# Altium schematic sheet WatchX_TEST_2.SchDoc
size A2
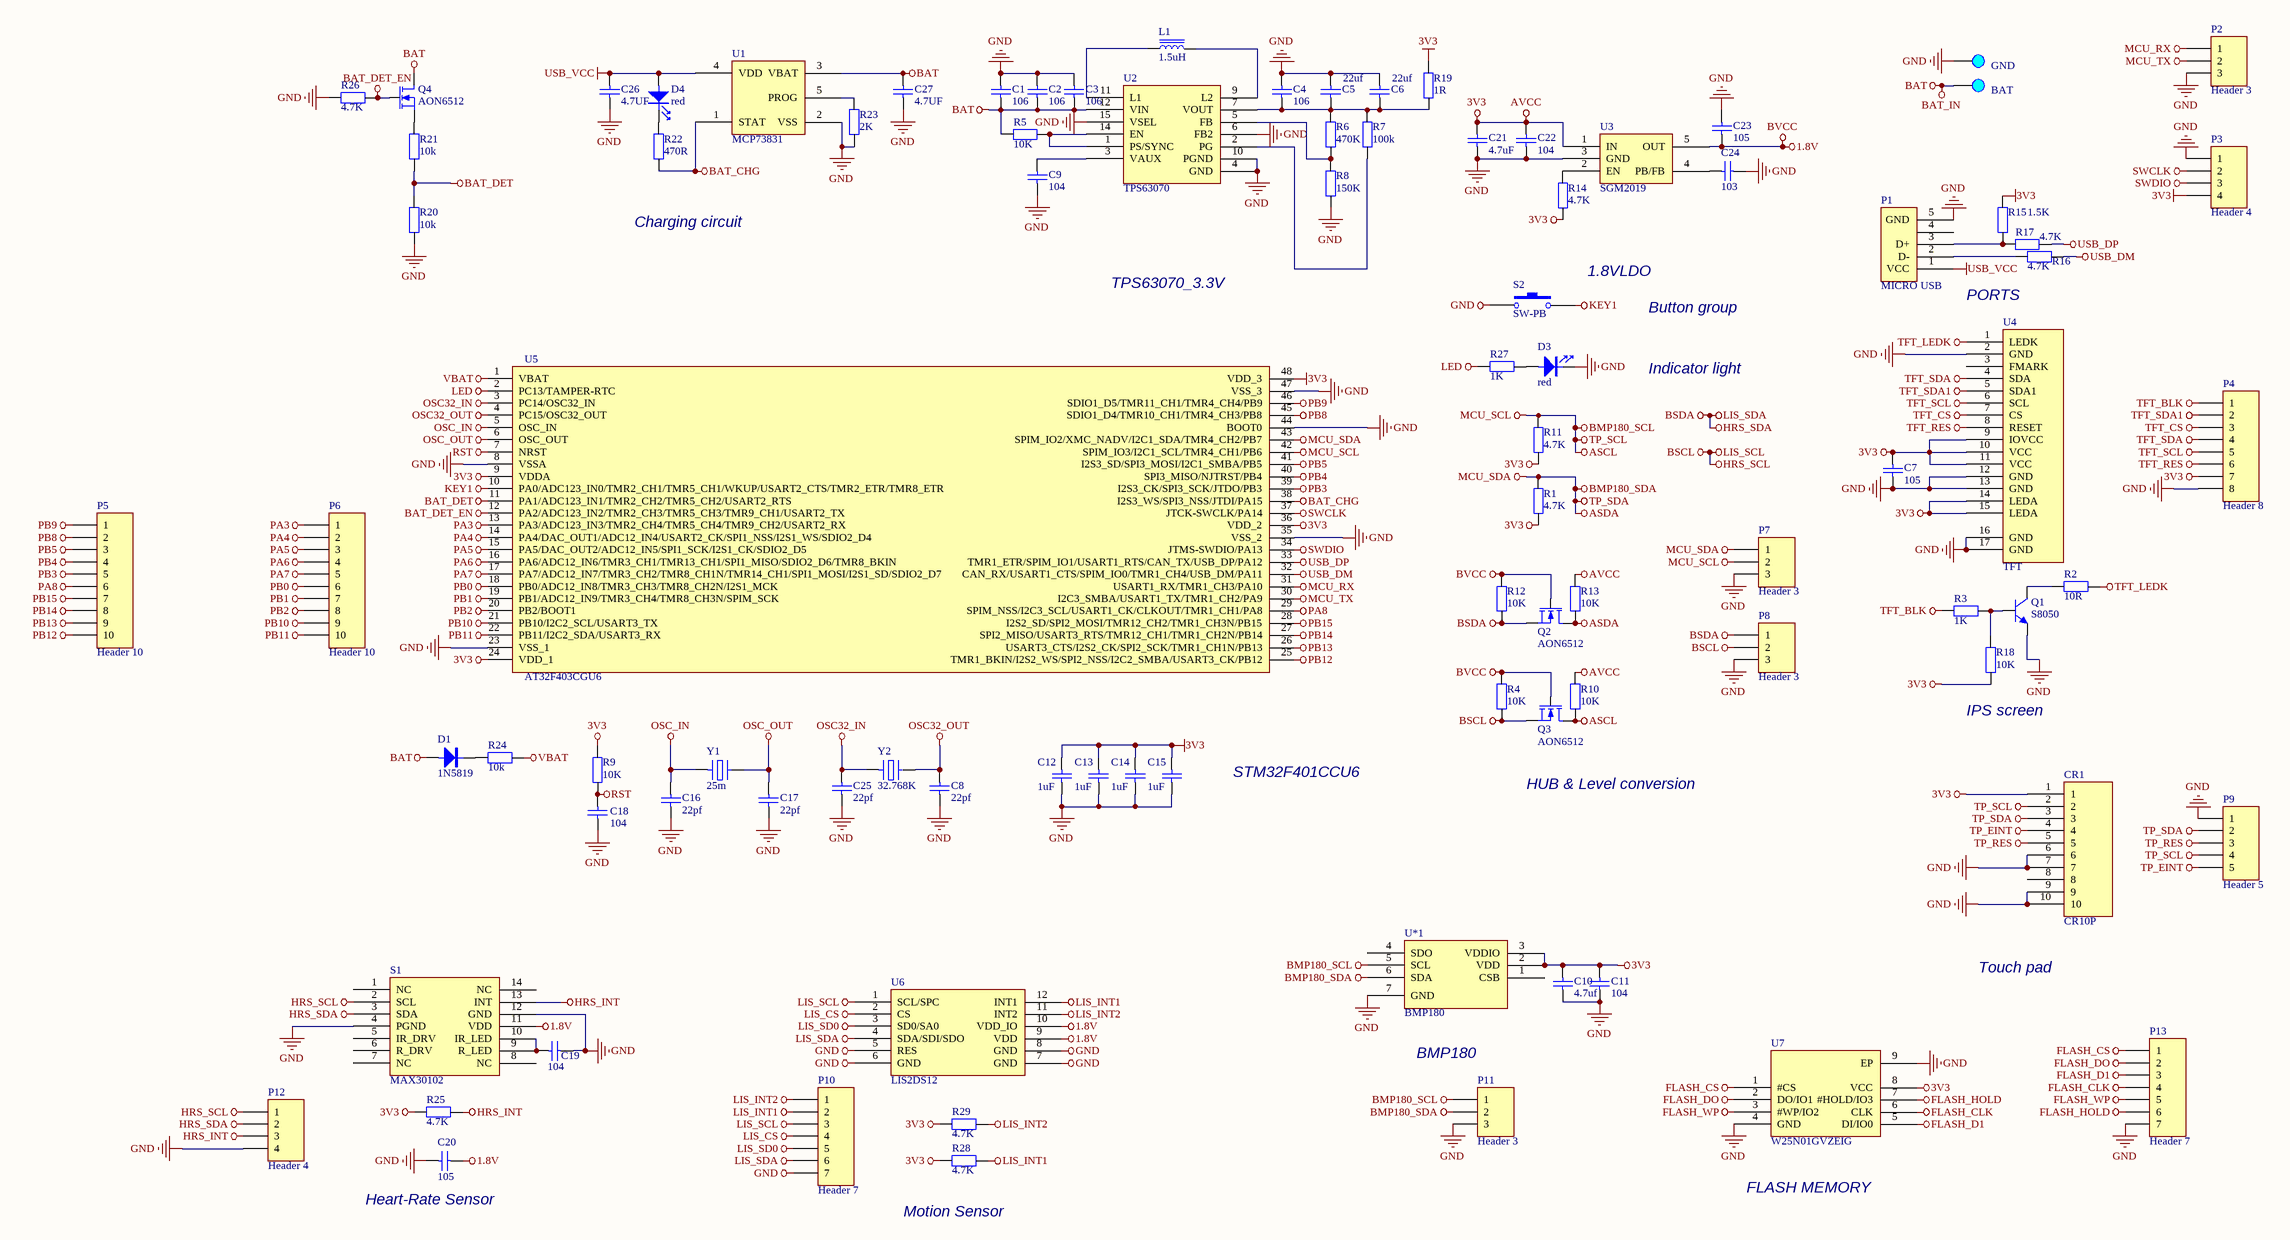
[diagram p0: WatchX_TEST_2.SchDoc]

## Parts
C1  106  [电容_C0805]
C2  106  [电容_C0805]
C3  106  [电容_C0603]
C4  106  [电容_C0603]
C5  22uf  [电容_C1206]
C6  22uf  [电容_C1206]
C7  105  [电容_C0603]
C8  22pf  [电容_C0603]
C9  104  [电容_C0603]
C10  4.7uf  [电容_C0603]
C11  104  [电容_C0603]
C12  1uF  [电容_C0603]
C13  1uF  [电容_C0603]
C14  1uF  [电容_C0603]
C15  1uF  [电容_C0603]
C16  22pf  [电容_C0603]
C17  22pf  [电容_C0603]
C18  104  [电容_C0603]
C19  104  [电容_C0603]
C20  105  [电容_C0603]
C21  4.7uF  [电容_C0603]
C22  104  [电容_C0603]
C23  105  [电容_C0603]
C24  103  [电容_C0603]
C25  22pf  [电容_C0603]
C26  4.7UF  [电容_C0805]
C27  4.7UF  [电容_C0805]
CR1  CR10P  [CONN RCPT 10POS 0.4MM]
D1  1N5819  [二极管_SOD-323]
D3  red  [LED_0603]
D4  red  [LED_0603]
L1  1.5uH  [变压器电感_0420]
P1  MICRO USB  [接插件_MICRO 牛角插座 USB 卷边]
P2  Header 3  [HDR1X3]
P3  Header 4  [HDR1X4]
P4  Header 8  [HDR1X8]
P5  Header 10  [HDR1X10]
P6  Header 10  [HDR1X10]
P7  Header 3  [HDR1X3]
P8  Header 3  [HDR1X3]
P9  Header 5  [HDR1X5]
P10  Header 7  [HDR1X7]
P11  Header 3  [HDR1X3]
P12  Header 4  [HDR1X4]
P13  Header 7  [HDR1X7]
Pad1  GND  [Pad_A]
Pad6  BAT  [Pad_A]
Q1  S8050  [三极管_SOT-23]
Q2  AON6512  [MOS_SOT-23]
Q3  AON6512  [MOS_SOT-23]
Q4  AON6512  [MOS_SOT-23]
R1  4.7K  [电阻_R0603]
R2  10R  [电阻_R0603]
R3  1K  [电阻_R0603]
R4  10K  [电阻_R0603]
R5  10K  [电阻_R0603]
R6  470K  [电阻_R0603]
R7  100k  [电阻_R0603]
R8  150K  [电阻_R0603]
R9  10K  [电阻_R0603]
R10  10K  [电阻_R0603]
R11  4.7K  [电阻_R0603]
R12  10K  [电阻_R0603]
R13  10K  [电阻_R0603]
R14  4.7K  [电阻_R0603]
R15  1.5K  [电阻_R0603]
R16  4.7K  [电阻_R0603]
R17  4.7K  [电阻_R0603]
R18  10K  [电阻_R0603]
R19  1R  [电阻_R0603]
R20  10k  [电阻_R0603]
R21  10k  [电阻_R0603]
R22  470R  [电阻_R0603]
R23  2K  [电阻_R0603]
R24  10k  [电阻_R0603]
R25  4.7K  [电阻_R0603]
R26  4.7K  [电阻_R0603]
R27  1K  [电阻_R0603]
R28  4.7K  [电阻_R0603]
R29  4.7K  [电阻_R0603]
S1  MAX30102  [MAX30102]
S2  SW-PB  [KEY_8*8mm]
U1  MCP73831  [SOT23-5]
U2  TPS63070  [VQFN-15-HR]
U3  SGM2019  [SOT23-5]
U4  TFT  [FPC-0.30mm-15P]
U5  AT32F403CGU6  [AT主控_QFN48(6X6)]
U6  LIS2DS12  [LGA-12_L2.0-W2.0-P0.50-BL]
U7  W25N01GVZEIG  [WSON-8]
U*1  BMP180  [LGA-7]
Y1  F: 25m  [晶振_2016]  (hidden comment: XTAL)
Y2  32.768K  [晶振_3215]

## Nets
1.8V: C20.1 C23.2 Q2.1(G) Q3.1(G) R4.1 R12.1 S1.11(VDD) U3.5(OUT) U6.9(VDD) U6.10(VDD_IO)  [also labelled BVCC]
3V3: C7.1 C10.2 C11.2 C12.2 C13.2 C14.2 C15.2 C21.1 C22.1 CR1.1 P3.4 P4.7 R1.2 R9.2 R10.1 R11.1 R13.1 R14.1 R15.2 R18.1 R19.2 R25.2 R28.2 R29.2 U3.1(IN) U4.9(IOVCC) U4.10(VCC) U4.11(VCC) U4.14(LEDA) U4.15(LEDA) U5.9(VDDA) U5.24(VDD_1) U5.36(VDD_2) U5.48(VDD_3) U7.8(VCC) U*1.2(VDD) U*1.3(VDDIO)  [also labelled AVCC]
ASCL: CR1.2 P7.2 P9.4 P11.1 Q3.2(D) R10.2 R11.2 U5.42(SPIM_IO3/I2C1_SCL/TMR4_CH1/PB6) U*1.5(SCL)  [also labelled BMP180_SCL, MCU_SCL, TP_SCL]
ASDA: CR1.3 P7.1 P9.2 P11.2 Q2.2(D) R1.1 R13.2 U5.43(SPIM_IO2/XMC_NADV/I2C1_SDA/TMR4_CH2/PB7) U*1.6(SDA)  [also labelled BMP180_SDA, MCU_SDA, TP_SDA]
BAT: C1.1 C2.1 C3.1 C27.2 D1.A Pad6.1 Q4.2(D) R5.2 U1.3(VBAT) U2.12(VIN)  [also labelled BAT_IN]
BAT_CHG: R22.1 U1.1(STAT) U5.38(I2S3_WS/SPI3_NSS/JTDI/PA15)
BAT_DET: R20.2 R21.1 U5.11(PA1/ADC123_IN1/TMR2_CH2/TMR5_CH2/USART2_RTS)
BAT_DET_EN: Q4.1(G) R26.1 U5.12(PA2/ADC123_IN2/TMR2_CH3/TMR5_CH3/TMR9_CH1/USART2_TX)
BSCL: P8.2 P10.3 P12.1 Q3.3(S) R4.2 S1.2(SCL) U6.1(SCL/SPC)  [also labelled HRS_SCL, LIS_SCL]
BSDA: P8.1 P10.6 P12.2 Q2.3(S) R12.2 S1.3(SDA) U6.4(SDA/SDI/SDO)  [also labelled HRS_SDA, LIS_SDA]
FLASH_CLK: P13.4 U7.6(CLK)
FLASH_CS: P13.1 U7.1(#CS)
FLASH_D1: P13.3 U7.5(DI/IO0)
FLASH_DO: P13.2 U7.2(DO/IO1)
FLASH_HOLD: P13.6 U7.7(#HOLD/IO3)
FLASH_WP: P13.5 U7.3(#WP/IO2)
GND: C1.2 C2.2 C3.2 C4.2 C5.2 C6.2 C7.2 C8.2 C9.1 C10.1 C11.1 C12.1 C13.1 C14.1 C15.1 C16.2 C17.2 C18.1 C19.1 C20.2 C21.2 C22.2 C23.1 C24.2 C25.2 C26.1 C27.1 CR1.6 CR1.7 CR1.9 CR1.10 D3.K P1.0 P1.5(GND) P2.3 P3.1 P4.8 P7.3 P8.3 P9.1 P10.7 P11.3 P12.4 P13.7 Pad1.1 Q1.3(E) R8.2 R20.1 R23.1 R26.2 S1.4(PGND) S1.12(GND) S2.1 U1.2(VSS) U2.4(GND) U2.6(FB2) U2.10(PGND) U2.15(VSEL) U3.3(GND) U4.2(GND) U4.12(GND) U4.13(GND) U4.16(GND) U4.17(GND) U5.0(VSS) U5.8(VSSA) U5.23(VSS_1) U5.35(VSS_2) U5.44(BOOT0) U5.47(VSS_3) U6.5(RES) U6.6(GND) U6.7(GND) U6.8(GND) U7.4(GND) U7.9(EP) U*1.7(GND)
HRS_INT: P12.3 R25.1 S1.13(INT)
KEY1: S2.2 U5.10(PA0/ADC123_IN0/TMR2_CH1/TMR5_CH1/WKUP/USART2_CTS/TMR2_ETR/TMR8_ETR)
LED: R27.1 U5.2(PC13/TAMPER-RTC)
LIS_CS: P10.4 U6.2(CS)
LIS_INT1: P10.2 R28.1 U6.12(INT1)
LIS_INT2: P10.1 R29.1 U6.11(INT2)
LIS_SD0: P10.5 U6.3(SD0/SA0)
MCU_RX: P2.1 U5.31(USART1_RX/TMR1_CH3/PA10)
MCU_TX: P2.2 U5.30(I2C3_SMBA/USART1_TX/TMR1_CH2/PA9)
OSC32_IN: C25.1 U5.3(PC14/OSC32_IN) Y2.1
OSC32_OUT: C8.1 U5.4(PC15/OSC32_OUT) Y2.2
OSC_IN: C16.1 U5.5(OSC_IN) Y1.1
OSC_OUT: C17.1 U5.6(OSC_OUT) Y1.2
PA3: P6.1 U5.13(PA3/ADC123_IN3/TMR2_CH4/TMR5_CH4/TMR9_CH2/USART2_RX)
PA4: P6.2 U5.14(PA4/DAC_OUT1/ADC12_IN4/USART2_CK/SPI1_NSS/I2S1_WS/SDIO2_D4)
PA5: P6.3 U5.15(PA5/DAC_OUT2/ADC12_IN5/SPI1_SCK/I2S1_CK/SDIO2_D5)
PA6: P6.4 U5.16(PA6/ADC12_IN6/TMR3_CH1/TMR13_CH1/SPI1_MISO/SDIO2_D6/TMR8_BKIN)
PA7: P6.5 U5.17(PA7/ADC12_IN7/TMR3_CH2/TMR8_CH1N/TMR14_CH1/SPI1_MOSI/I2S1_SD/SDIO2_D7)
PA8: P5.6 U5.29(SPIM_NSS/I2C3_SCL/USART1_CK/CLKOUT/TMR1_CH1/PA8)
PB0: P6.6 U5.18(PB0/ADC12_IN8/TMR3_CH3/TMR8_CH2N/I2S1_MCK)
PB1: P6.7 U5.19(PB1/ADC12_IN9/TMR3_CH4/TMR8_CH3N/SPIM_SCK)
PB2: P6.8 U5.20(PB2/BOOT1)
PB3: P5.5 U5.39(I2S3_CK/SPI3_SCK/JTDO/PB3)
PB4: P5.4 U5.40(SPI3_MISO/NJTRST/PB4)
PB5: P5.3 U5.41(I2S3_SD/SPI3_MOSI/I2C1_SMBA/PB5)
PB8: P5.2 U5.45(SDIO1_D4/TMR10_CH1/TMR4_CH3/PB8)
PB9: P5.1 U5.46(SDIO1_D5/TMR11_CH1/TMR4_CH4/PB9)
PB10: P6.9 U5.21(PB10/I2C2_SCL/USART3_TX)
PB11: P6.10 U5.22(PB11/I2C2_SDA/USART3_RX)
PB12: P5.10 U5.25(TMR1_BKIN/I2S2_WS/SPI2_NSS/I2C2_SMBA/USART3_CK/PB12)
PB13: P5.9 U5.26(USART3_CTS/I2S2_CK/SPI2_SCK/TMR1_CH1N/PB13)
PB14: P5.8 U5.27(SPI2_MISO/USART3_RTS/TMR12_CH1/TMR1_CH2N/PB14)
PB15: P5.7 U5.28(I2S2_SD/SPI2_MOSI/TMR12_CH2/TMR1_CH3N/PB15)
RST: C18.2 R9.1 U5.7(NRST)
SWCLK: P3.2 U5.37(JTCK-SWCLK/PA14)
SWDIO: P3.3 U5.34(JTMS-SWDIO/PA13)
TFT_BLK: P4.1 R3.1
TFT_CS: P4.3 U4.7(CS)
TFT_LEDK: R2.2 U4.1(LEDK)
TFT_RES: P4.6 U4.8(RESET)
TFT_SCL: P4.5 U4.6(SCL)
TFT_SDA: P4.4 U4.4(SDA)
TFT_SDA1: P4.2 U4.5(SDA1)
TP_EINT: CR1.4 P9.5
TP_RES: CR1.5 P9.3
USB_DM: R16.2 U5.32(CAN_RX/USART1_CTS/SPIM_IO0/TMR1_CH4/USB_DM/PA11)
USB_DP: R17.2 U5.33(TMR1_ETR/SPIM_IO1/USART1_RTS/CAN_TX/USB_DP/PA12)
USB_VCC: C26.2 D4.A P1.1(VCC) U1.4(VDD)
VBAT: R24.1 U5.1(VBAT)
NetC4_1: C4.1 C5.1 C6.1 R6.1 R7.1 R19.1 U2.7(VOUT)
NetC9_2: C9.2 U2.3(VAUX)
NetC19_2: C19.2 S1.9(R_LED) S1.10(IR_LED)
NetC24_1: C24.1 U3.4(PB/FB)
NetD1_K: D1.K R24.2
NetD3_A: D3.A R27.2
NetD4_K: D4.K R22.2
NetL1_1: L1.1 U2.11(L1)
NetL1_2: L1.2 U2.9(L2)
NetP1_2: P1.2(D-) R16.1
NetP1_3: P1.3(D+) R15.1 R17.1
NetQ1_1: Q1.1(B) R3.2 R18.2
NetQ1_2: Q1.2(C) R2.1
NetQ4_3: Q4.3(S) R21.2
NetR5_1: R5.1 U2.1(PS/SYNC) U2.14(EN)
NetR6_2: R6.2 R8.1 U2.5(FB)
NetR7_2: R7.2 U2.2(PG)
NetR14_2: R14.2 U3.2(EN)
NetR23_2: R23.2 U1.5(PROG)

Not connected (* = marked no-connect by the designer): CR1 8; P1 4; S1 1(NC) 5(IR_DRV) 6(R_DRV) 7(NC) 8(NC) 14(NC); U4 3(FMARK); U*1 1(CSB) 4(SDO)

## Notes on the sheet
- Charging circuit
- 1.8VLDO
- TPS63070_3.3V
- Button group
- PORTS
- Indicator light
- (near R18) IPS screen
- STM32F401CCU6
- HUB & Level conversion
- Touch pad
- BMP180
- FLASH MEMORY
- (near C20) Heart-Rate Sensor
- (near R28) Motion Sensor

## Library data of the parts
C1-C27 = cap: U: 50V; 参数: Cap,0805,X7R,104K,50V,125C,±10%
  C1-C4: C: 106
  C5 C6: C: 22uf
  C7 C20 C23: C: 105
  C8 C16 C17 C25: C: 22pf
  C9 C11 C18 C19 C22: C: 104
  C10: C: 4.7uf
  C12-C15: C: 1uF
  C21: C: 4.7uF
  C24: C: 103
  C26 C27: C: 4.7UF
CR1 = CONN RCPT 10P: 板对板连接器
D1 = Diode: _Specification: Diode,1N5819,SOD-323,1A,40V; _Comma: ,; _Footprint: SOD-323; _Voltage: 40V; _Current: 1A; _Name: Diode; _Model: 1N5819
D3 D4 = LED: 参数: LED,0603,Red
L1 = Inductor Iron 2: _Current: 10A; _Accuracy: 20%; _Footprint: 1040; _Name: IND; _Specification: IND,1040,1.5uH,10A,20%; _Comma: ,; _Value: 1.5uH
P1 = MICRO USB 5PIN: _Comma: ,; _Name: Port; _Specification: Port,MICRO USB,5PIN; _Value: 5PIN; _Model: MICRO USB
P2 P7 P8 P11 = Header 3: Header, 3-Pin; LatestRevisionDate: 17-Jul-2002; LatestRevisionNote: Re-released for DXP Platform.; Publisher: Altium Limited
P3 P12 = Header 4: Header, 4-Pin; LatestRevisionDate: 17-Jul-2002; LatestRevisionNote: Re-released for DXP Platform.; Publisher: Altium Limited
P4 = Header 8: Header, 8-Pin; LatestRevisionDate: 17-Jul-2002; LatestRevisionNote: Re-released for DXP Platform.; Publisher: Altium Limited
P5 P6 = Header 10: Header, 10-Pin; LatestRevisionDate: 17-Jul-2002; LatestRevisionNote: Re-released for DXP Platform.; Publisher: Altium Limited
P9 = Header 5: Header, 5-Pin; LatestRevisionDate: 17-Jul-2002; LatestRevisionNote: Re-released for DXP Platform.; Publisher: Altium Limited
P10 P13 = Header 7: Header, 7-Pin; LatestRevisionDate: 17-Jul-2002; LatestRevisionNote: Re-released for DXP Platform.; Publisher: Altium Limited
Pad1 = Pad: _Funcyusa: Test; _Specification: Pad,Test,GND; _Comma: ,; _Name: Pad; _Remarks: GND
Pad6 = Pad: _Funcyusa: Test; _Specification: Pad,Test,BAT; _Comma: ,; _Name: Pad; _Remarks: BAT
Q1 = Triode-NPN: _Comma: ,; _Current: 500mA; _Footprint: SOT-23; _Name: Triode; _Specification: Triode,NPN,S8050,SOT-23,500mA,40V; _Voltage: 40V; _Polarity: NPN; _Model: S8050
Q2-Q4 = MOSFET-N: _Comma: ,; _Current: 150A; _Footprint: DFN5*6; _Name: N-MOSFET; _Specification: N-MOSFET,AON6512,DFN5*6,150A,30V; _Voltage: 30V; _Model: AON6512
R1 R4-R17 R19-R29 = Res: P: 1/8W; 参数: Res,0805,0R,±1%,1/8W,100ppm,155C
  R1 R11 R14 R16 R17 R25 R26 R28 R29: R: 4.7K
  R4 R5 R9 R10 R12 R13: R: 10K
  R6: R: 470K
  R7: R: 100k
  R8: R: 150K
  R15: R: 1.5K
  R19: R: 1R
  R20 R21 R24: R: 10k
  R22: R: 470R
  R23: R: 2K
  R27: R: 1K
R2 = Res: _Accuracy: 1%; _Power: 1/8W; _Footprint: 0805; _Drift: 100ppm; _Comma: ,; _Specification: Res,0805,10R,1%,1/8W,100ppm; _Name: Res; _Value: 10R
R3 = Res: _Accuracy: 1%; _Power: 1/8W; _Footprint: 0805; _Drift: 100ppm; _Comma: ,; _Specification: Res,0805,1K,1%,1/8W,100ppm; _Name: Res; _Value: 1K
R18 = Res: _Accuracy: 1%; _Power: 1/8W; _Footprint: 0805; _Drift: 100ppm; _Comma: ,; _Specification: Res,0805,10K,1%,1/8W,100ppm; _Name: Res; _Value: 10K
S1 = MAX30102: 血氧浓度传感器
S2 = SW-PB: 按键
U1 = MCP73831: 线性充电管理控制器
U2 = TPS63070: 降压-升压转换器
U3 = SGM2019: 低压差稳压芯片
U4 = TFT_IPS1-1.54寸240*240-AML015410V1: IPS电容式触摸屏
U5 = AT32F403CGU6: _Footprint: QFN48; _Comma: ,; _Name: MCU; _Specification: MCU,AT32F403CGU6,QFN48; _Model: AT32F403CGU6
U6 = LIS2DS12: 运动传感器
U7 = W25N01GVZEIG: 华邦flash 1GBit
U*1 = BMP180: 数字气压传感器
Y2 = XTAL_A: _Name: CRYSTALS; _Comma: ,; _Specification: CRYSTALS,32.768K,*,10ppm,12pF; _Accuracy: 10ppm; _CL: 12pF; _Footprint: *; _Frequency: 32.768K